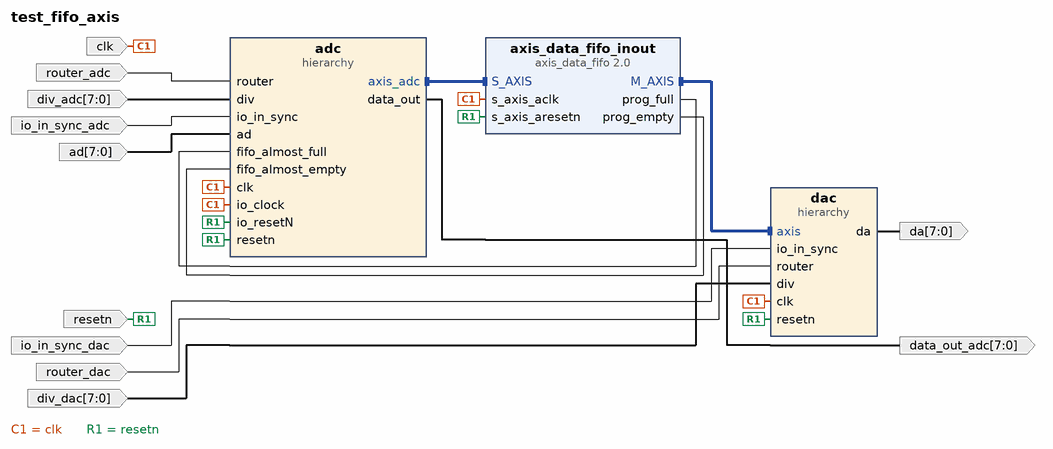
[diagram p0: block diagram of the top level]
# Vivado block design test_fifo_axis, xc7z020clg400-2, Vivado 2018.3
create_bd_design test_fifo_axis

create_bd_port -dir I -type clk clk
set_property -dict {CONFIG.FREQ_HZ 60000000 CONFIG.PHASE 0.0} [get_bd_ports clk]
create_bd_port -dir I -type rst resetn
create_bd_port -dir I router_adc
create_bd_port -dir I io_in_sync_dac
create_bd_port -dir I -from 7 -to 0 div_adc
create_bd_port -dir I io_in_sync_adc
create_bd_port -dir I router_dac
create_bd_port -dir I -from 7 -to 0 ad
create_bd_port -dir I -from 7 -to 0 div_dac
create_bd_port -dir O -from 7 -to 0 da
create_bd_port -dir O -from 7 -to 0 data_out_adc

create_bd_cell -type hier dac
create_bd_cell -type hier adc
create_bd_cell -type ip -vlnv xilinx.com:ip:axis_data_fifo:2.0 axis_data_fifo_inout
set_property -dict [list \
  CONFIG.FIFO_DEPTH 16384 \
  CONFIG.HAS_AEMPTY 1 \
  CONFIG.HAS_AFULL 1 \
  CONFIG.HAS_PROG_EMPTY 1 \
  CONFIG.HAS_PROG_FULL 1 \
  CONFIG.HAS_WR_DATA_COUNT 0 \
  CONFIG.PROG_FULL_THRESH 2048 \
] [get_bd_cells axis_data_fifo_inout]

# ---- hierarchy /dac ----
current_bd_instance /dac
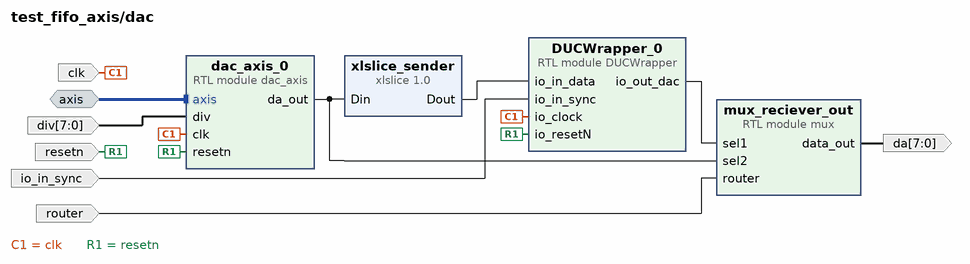
[diagram p1: block diagram inside /dac]
create_bd_intf_pin -mode Slave -vlnv xilinx.com:interface:axis_rtl:1.0 axis
create_bd_pin -dir I -type clk clk
create_bd_pin -dir O -from 7 -to 0 da
create_bd_pin -dir I -from 7 -to 0 div
create_bd_pin -dir I io_in_sync
create_bd_pin -dir I -type rst resetn
create_bd_pin -dir I router

create_bd_cell -type module -reference DUCWrapper DUCWrapper_0
create_bd_cell -type module -reference mux mux_reciever_out
create_bd_cell -type ip -vlnv xilinx.com:ip:xlslice:1.0 xlslice_sender
set_property -dict {CONFIG.DIN_FROM 0 CONFIG.DIN_TO 0 CONFIG.DIN_WIDTH 8} [get_bd_cells xlslice_sender]
create_bd_cell -type module -reference dac_axis dac_axis_0

# ---- hierarchy /adc ----
current_bd_instance /adc
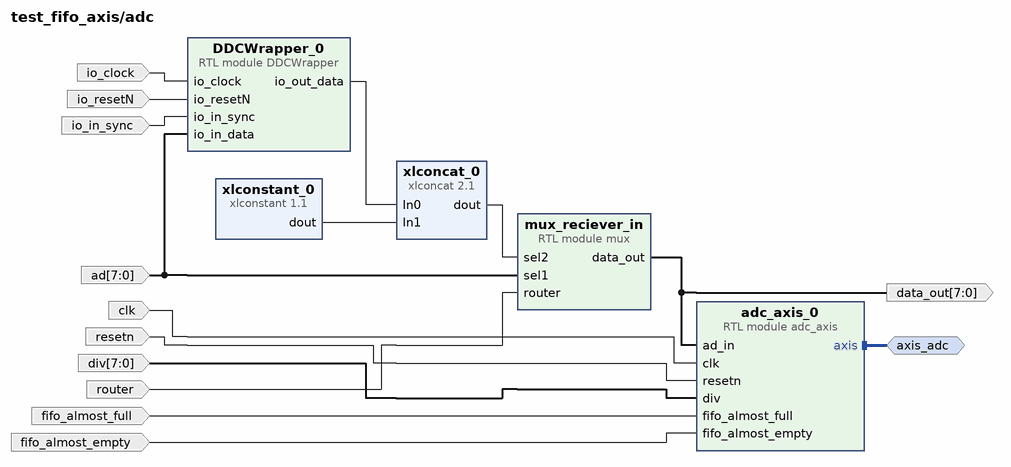
[diagram p2: block diagram inside /adc]
create_bd_intf_pin -mode Master -vlnv xilinx.com:interface:axis_rtl:1.0 axis_adc
create_bd_pin -dir I -from 7 -to 0 ad
create_bd_pin -dir I -type clk clk
create_bd_pin -dir I -from 7 -to 0 div
create_bd_pin -dir I -type clk io_clock
create_bd_pin -dir I io_in_sync
create_bd_pin -dir I -type rst io_resetN
create_bd_pin -dir I -type rst resetn
create_bd_pin -dir I router
create_bd_pin -dir O -from 7 -to 0 data_out
create_bd_pin -dir I fifo_almost_full
create_bd_pin -dir I fifo_almost_empty

create_bd_cell -type module -reference DDCWrapper DDCWrapper_0
create_bd_cell -type module -reference mux mux_reciever_in
create_bd_cell -type ip -vlnv xilinx.com:ip:xlconcat:2.1 xlconcat_0
create_bd_cell -type ip -vlnv xilinx.com:ip:xlconstant:1.1 xlconstant_0
set_property -dict {CONFIG.CONST_VAL 0 CONFIG.CONST_WIDTH 7} [get_bd_cells xlconstant_0]
create_bd_cell -type module -reference adc_axis adc_axis_0

# ---- connections ----

current_bd_instance /dac
connect_bd_intf_net [get_bd_intf_pins axis] [get_bd_intf_pins dac_axis_0/axis]
connect_bd_net [get_bd_pins DUCWrapper_0/io_out_dac] [get_bd_pins mux_reciever_out/sel1]
connect_bd_net -net clk_wiz_0_clk_out1 [get_bd_pins clk] [get_bd_pins DUCWrapper_0/io_clock] [get_bd_pins dac_axis_0/clk]
connect_bd_net -net mux_0_data_out [get_bd_pins mux_reciever_out/data_out] [get_bd_pins da]
connect_bd_net -net rst_ps7_0_50M_peripheral_aresetn [get_bd_pins resetn] [get_bd_pins DUCWrapper_0/io_resetN] [get_bd_pins dac_axis_0/resetn]
connect_bd_net -net xlslice_dac_8_15_Dout [get_bd_pins div] [get_bd_pins dac_axis_0/div]
connect_bd_net -net xlslice_duc_sync_6_Dout [get_bd_pins io_in_sync] [get_bd_pins DUCWrapper_0/io_in_sync]
connect_bd_net -net xlslice_reciever_out_7_Dout [get_bd_pins router] [get_bd_pins mux_reciever_out/router]
connect_bd_net [get_bd_pins xlslice_sender/Dout] [get_bd_pins DUCWrapper_0/io_in_data]
connect_bd_net [get_bd_pins dac_axis_0/da_out] [get_bd_pins xlslice_sender/Din] [get_bd_pins mux_reciever_out/sel2]

current_bd_instance /adc
connect_bd_intf_net [get_bd_intf_pins axis_adc] [get_bd_intf_pins adc_axis_0/axis]
connect_bd_net [get_bd_pins DDCWrapper_0/io_out_data] [get_bd_pins xlconcat_0/In0]
connect_bd_net [get_bd_pins clk] [get_bd_pins adc_axis_0/clk]
connect_bd_net [get_bd_pins resetn] [get_bd_pins adc_axis_0/resetn]
connect_bd_net [get_bd_pins io_clock] [get_bd_pins DDCWrapper_0/io_clock]
connect_bd_net [get_bd_pins io_resetN] [get_bd_pins DDCWrapper_0/io_resetN]
connect_bd_net [get_bd_pins ad] [get_bd_pins DDCWrapper_0/io_in_data] [get_bd_pins mux_reciever_in/sel1]
connect_bd_net [get_bd_pins div] [get_bd_pins adc_axis_0/div]
connect_bd_net [get_bd_pins io_in_sync] [get_bd_pins DDCWrapper_0/io_in_sync]
connect_bd_net [get_bd_pins mux_reciever_in/data_out] [get_bd_pins data_out] [get_bd_pins adc_axis_0/ad_in]
connect_bd_net [get_bd_pins xlconcat_0/dout] [get_bd_pins mux_reciever_in/sel2]
connect_bd_net [get_bd_pins xlconstant_0/dout] [get_bd_pins xlconcat_0/In1]
connect_bd_net -net xlslice_reciever_in_10_Dout [get_bd_pins router] [get_bd_pins mux_reciever_in/router]
connect_bd_net [get_bd_pins fifo_almost_full] [get_bd_pins adc_axis_0/fifo_almost_full]
connect_bd_net [get_bd_pins fifo_almost_empty] [get_bd_pins adc_axis_0/fifo_almost_empty]

current_bd_instance /
connect_bd_intf_net [get_bd_intf_pins axis_data_fifo_inout/S_AXIS] [get_bd_intf_pins adc/axis_adc]
connect_bd_intf_net [get_bd_intf_pins axis_data_fifo_inout/M_AXIS] [get_bd_intf_pins dac/axis]
connect_bd_net -net clk_0_1 [get_bd_ports clk] \
  [get_bd_pins adc/clk] [get_bd_pins dac/clk] [get_bd_pins axis_data_fifo_inout/s_axis_aclk] [get_bd_pins adc/io_clock]
connect_bd_net -net resetn_0_1 [get_bd_ports resetn] \
  [get_bd_pins adc/resetn] [get_bd_pins dac/resetn] [get_bd_pins axis_data_fifo_inout/s_axis_aresetn] \
  [get_bd_pins adc/io_resetN]
connect_bd_net -net router_0_1 [get_bd_ports router_adc] [get_bd_pins adc/router]
connect_bd_net -net io_in_sync_0_1 [get_bd_ports io_in_sync_dac] [get_bd_pins dac/io_in_sync]
connect_bd_net -net div_0_1 [get_bd_ports div_adc] [get_bd_pins adc/div]
connect_bd_net -net io_in_sync_1_1 [get_bd_ports io_in_sync_adc] [get_bd_pins adc/io_in_sync]
connect_bd_net -net router_1_1 [get_bd_ports router_dac] [get_bd_pins dac/router]
connect_bd_net -net ad_0_1 [get_bd_ports ad] [get_bd_pins adc/ad]
connect_bd_net -net div_1_1 [get_bd_ports div_dac] [get_bd_pins dac/div]
connect_bd_net [get_bd_pins dac/da] [get_bd_ports da]
connect_bd_net [get_bd_pins adc/data_out] [get_bd_ports data_out_adc]
connect_bd_net [get_bd_pins axis_data_fifo_inout/prog_full] [get_bd_pins adc/fifo_almost_full]
connect_bd_net [get_bd_pins axis_data_fifo_inout/prog_empty] [get_bd_pins adc/fifo_almost_empty]

validate_bd_design
save_bd_design
